# Altium schematic sheet Eurocard VME 3U (3.937 x 6.299 inches).schdoc: Eurocard VME 3U (3.937 x 6.299 inches)
size A; Organization: Organization; Address1: Address1; Address2: Address2; Address3: Address3; Address4: Address4; DocumentNumber: 1; Revision: 0; SheetNumber: 2; SheetTotal: 2
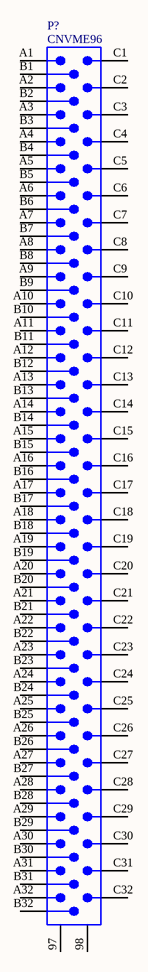
[diagram p0: Eurocard VME 3U (3.937 x 6.299 inches).schdoc]

## Parts
P?  CNVME96  [CNVME96]

## Nets

Not connected (* = marked no-connect by the designer): P? 97 98 A1 A2 A3 A4 A5 A6 A7 A8 A9 A10 A11 A12 A13 A14 A15 A16 A17 A18 A19 A20 A21 A22 A23 A24 A25 A26 A27 A28 A29 A30 A31 A32 B1 B2 B3 B4 B5 B6 B7 B8 B9 B10 B11 B12 B13 B14 B15 B16 B17 B18 B19 B20 B21 B22 B23 B24 B25 B26 B27 B28 B29 B30 B31 B32 C1 C2 C3 C4 C5 C6 C7 C8 C9 C10 C11 C12 C13 C14 C15 C16 C17 C18 C19 C20 C21 C22 C23 C24 C25 C26 C27 C28 C29 C30 C31 C32

## Library data of the parts
P? = CNVME96: 96-Pin Connector (3x32 2.54mm grid); Text Field6: Alternate Layout Available; Text Field7: Published 14-Feb-2002